# Altium schematic sheet FLASH.SchDoc
size A4; SheetNumber: 5; SheetTotal: 7
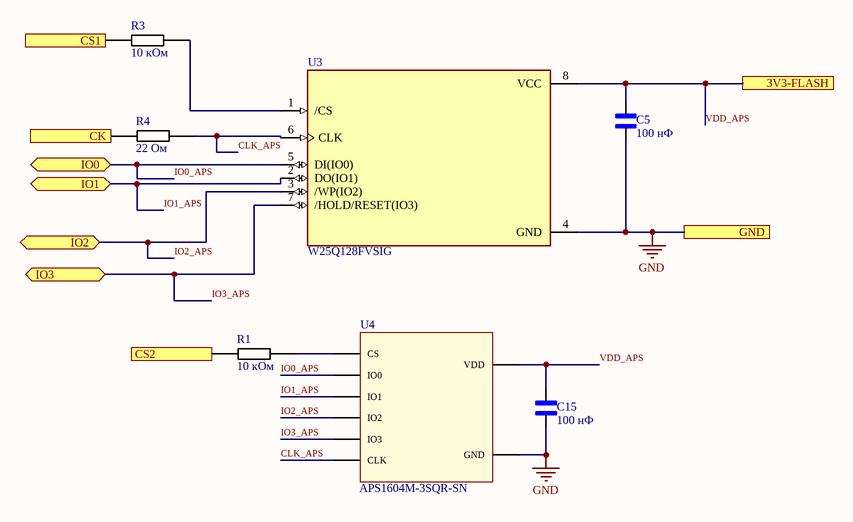
[diagram p0: FLASH.SchDoc]

## Parts
C5  100 нФ  [CAPC1005X22N]
C15  100 нФ  [CAPC1005X22N]
R1  10 кОм  [Yageo RC0805JR-0710KL]
R3  10 кОм  [Yageo RC0805JR-0710KL]
R4  22 Ом  [CR0805-JW-220ELF]
U3  W25Q128FVSIG  [SOIC127P790X216-8N]
U4  APS1604M-3SQR-SN  [APS1604M (SOP-8)]

## Ports
3V3-FLASH (see TOP_LEVEL[1B], POWER_IN[3B]), CK (in, see TOP_LEVEL[1B], MODULES[3B]), CS1 (in, see TOP_LEVEL[1B], MODULES[3B]), CS2 (in, see TOP_LEVEL[1C], MODULES[3B]), GND (see TOP_LEVEL[1C], MODULES[2D], NFC[2C], POWER_IN[3C], SWD[2B], USB[3B]), IO0 (bidir, see TOP_LEVEL[1B], MODULES[3B]), IO1 (bidir, see TOP_LEVEL[1B], MODULES[3B]), IO2 (bidir, see TOP_LEVEL[1C], MODULES[3B]), IO3 (bidir, see TOP_LEVEL[1C], MODULES[3B])

## Nets
GND: C5.1 C15.1 U3.4(GND) U4.4(GND) ; port GND
CK: R4.1 ; port CK
CLK_APS: R4.2 U3.6(CLK) U4.6(CLK)
CS1: R3.1 ; port CS1
CS2: R1.1 ; port CS2
IO0_APS: U3.5(DI(IO0)) U4.5(IO0) ; port IO0
IO1_APS: U3.2(DO(IO1)) U4.2(IO1) ; port IO1
IO2_APS: U3.3(/WP(IO2)) U4.3(IO2) ; port IO2
IO3_APS: U3.7(/HOLD/RESET(IO3)) U4.7(IO3) ; port IO3
VDD_APS: C5.2 C15.2 U3.8(VCC) U4.8(VDD) ; port 3V3-FLASH
NetR1_2: R1.2 U4.1(CS)
NetR3_2: R3.2 U3.1(/CS)

## Library data of the parts
C5 C15 = GRM152R60J104KE19D: SMD Capacitor X5R(EIA) with Capacitance: 0.10uF Tol. 10%. Rated Voltage: 6.3Vdc; MF: Murata; SnapEDA_Link: https://www.snapeda.com/parts/GRM152R60J104KE19D/Murata/view-part/?ref=snap; Package: 1005 Murata; Value: *; MP: GRM152R60J104KE19D; Check_prices: https://www.snapeda.com/parts/GRM152R60J104KE19D/Murata/view-part/?ref=eda
R1 R3 = Yageo RC0805JR-0710KL
R4 = CR0805-JW-220ELF
U3 = W25Q128JVSIQ: FLASH - NOR Memory IC 128Mb (16M x 8) SPI - Quad I/O, QPI, DTR 133 MHz 8-SOIC; MF: Winbond Electronics; SnapEDA_Link: https://www.snapeda.com/parts/W25Q128JVSIQ/Winbond/view-part/?ref=snap; Package: SOIC-8 Winbond Electronics; Value: *; MP: W25Q128JVSIQ; Check_prices: https://www.snapeda.com/parts/W25Q128JVSIQ/Winbond/view-part/?ref=eda
U4 = APS1604M